# Altium schematic sheet adcbuffer.SchDoc
size A4; SheetNumber: 7; SheetTotal: 8
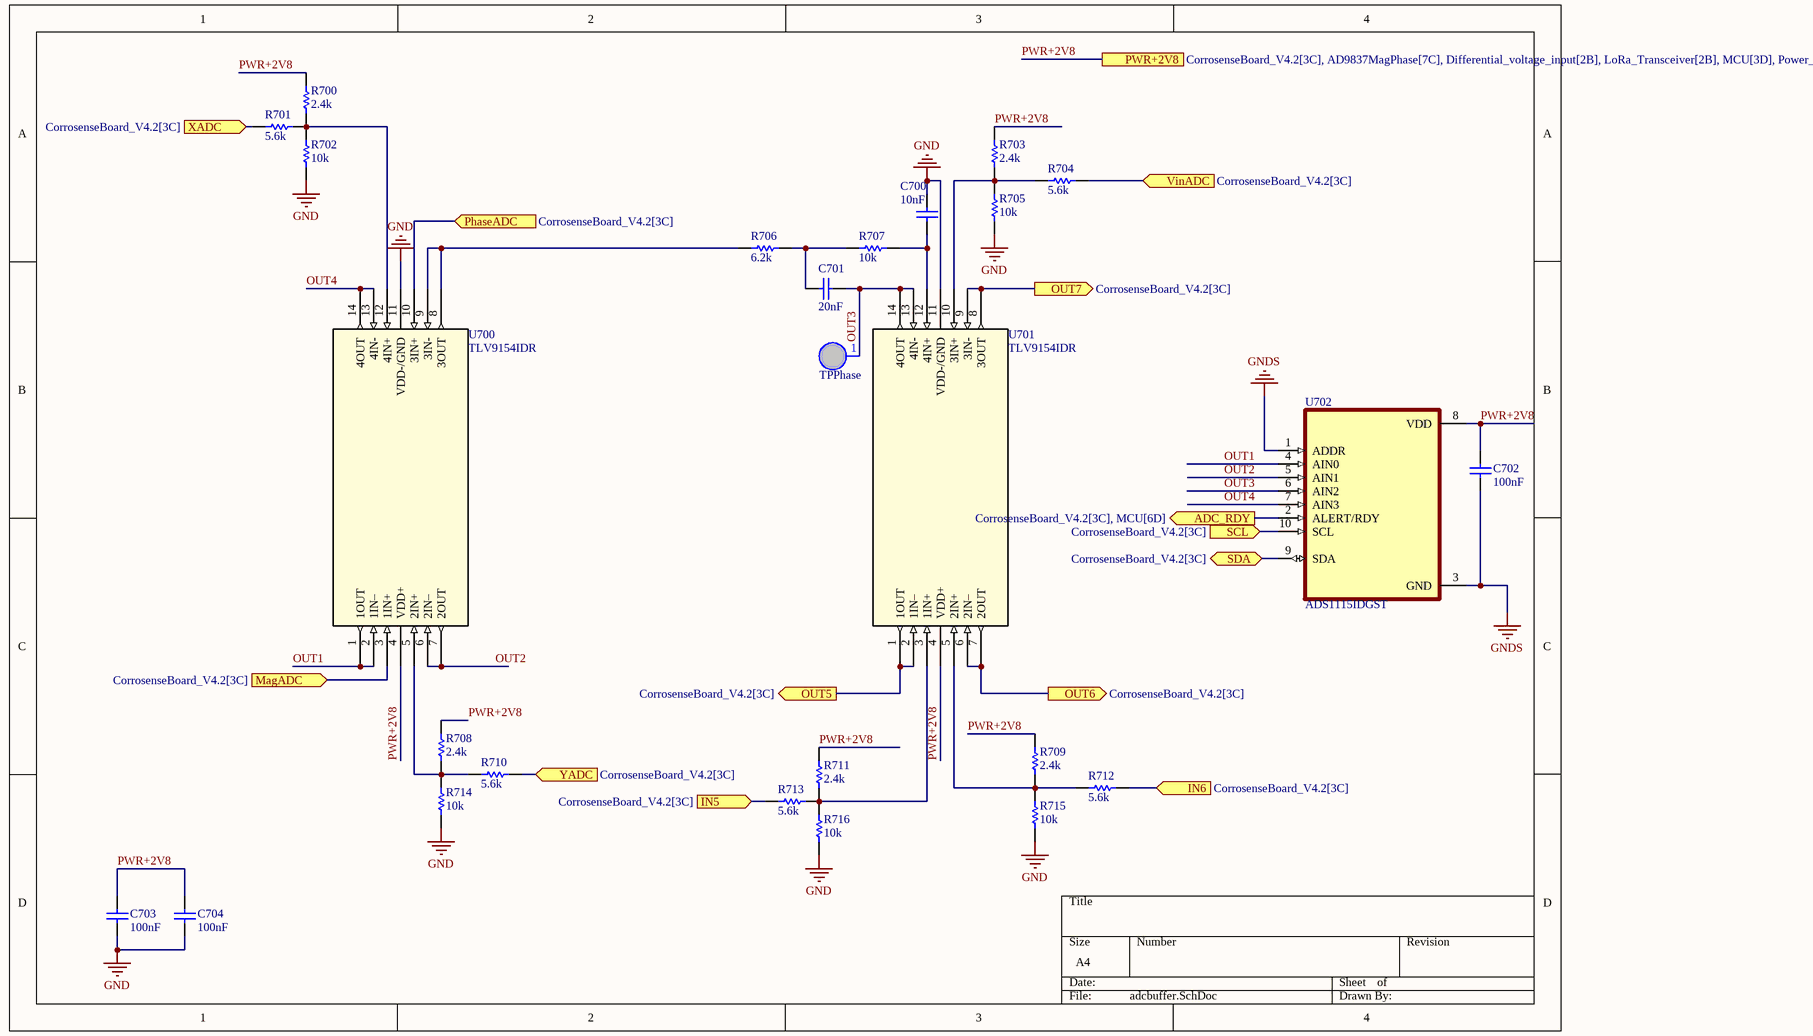
[diagram p0: adcbuffer.SchDoc]

## Parts
C700  10nF  [1608[0603]]
C701  20nF  [1608[0603]]
C702  100nF  [1608[0603]]
C703  100nF  [1608[0603]]
C704  100nF  [1608[0603]]
R700  2.4k  [1608[0603]]
R701  5.6k  [1608[0603]]
R702  10k  [1608[0603]]
R703  2.4k  [1608[0603]]
R704  5.6k  [1608[0603]]
R705  10k  [1608[0603]]
R706  6.2k  [1608[0603]]
R707  10k  [1608[0603]]
R708  2.4k  [1608[0603]]
R709  2.4k  [1608[0603]]
R710  5.6k  [1608[0603]]
R711  2.4k  [1608[0603]]
R712  5.6k  [1608[0603]]
R713  5.6k  [1608[0603]]
R714  10k  [1608[0603]]
R715  10k  [1608[0603]]
R716  10k  [1608[0603]]
TPPhase  TP  [PCBComponent_1]  (value not drawn)  (no BOM)
U700  TLV9154IDR  [SOIC127P600X175-14N]
U701  TLV9154IDR  [SOIC127P600X175-14N]
U702  ADS1115IDGST  [SOP50P490X110-10N]

## Ports
ADC_RDY (out, see CorrosenseBoard_V4.2[3C], MCU[6D]), IN5 (in, see CorrosenseBoard_V4.2[3C]), IN6 (in, see CorrosenseBoard_V4.2[3C]), MagADC (in, see CorrosenseBoard_V4.2[3C]), OUT5 (out, see CorrosenseBoard_V4.2[3C]), OUT6 (out, see CorrosenseBoard_V4.2[3C]), OUT7 (out, see CorrosenseBoard_V4.2[3C]), PhaseADC (in, see CorrosenseBoard_V4.2[3C]), PWR+2V8 (see CorrosenseBoard_V4.2[3C], AD9837MagPhase[7C], Differential_voltage_input[2B], LoRa_Transceiver[2B], MCU[3D], Power_management[3C]), SCL (in, see CorrosenseBoard_V4.2[3C]), SDA (bidir, see CorrosenseBoard_V4.2[3C]), VinADC (in, see CorrosenseBoard_V4.2[3C]), XADC (in, see CorrosenseBoard_V4.2[3C]), YADC (in, see CorrosenseBoard_V4.2[3C])

## Nets
GND: C700.2 C703.2 C704.2 R702.1 R705.1 R714.1 R715.1 R716.1 U700.11(VDD-/GND) U701.11(VDD-/GND)
GNDS: C702.2 U702.1(ADDR) U702.3(GND)
ADC_RDY: U702.2(ALERT/RDY) ; port ADC_RDY
IN5: R713.2 ; port IN5
IN6: R712.2 ; port IN6
MagADC: U700.3(1IN+) ; port MagADC
OUT1: U700.1(1OUT) U700.2(1IN–) U702.4(AIN0)
OUT2: U700.6(2IN–) U700.7(2OUT) U702.5(AIN1)
OUT3: C701.2 TPPhase.1 U701.13(4IN-) U701.14(4OUT) U702.6(AIN2)
OUT4: U700.13(4IN-) U700.14(4OUT) U702.7(AIN3)
OUT5: U701.1(1OUT) U701.2(1IN–) ; port OUT5
OUT6: U701.6(2IN–) U701.7(2OUT) ; port OUT6
OUT7: U701.8(3OUT) U701.9(3IN-) ; port OUT7
PhaseADC: U700.10(3IN+) ; port PhaseADC
PWR+2V8: C702.1 C703.1 C704.1 R700.2 R703.2 R708.2 R709.2 R711.2 U700.4(VDD+) U701.4(VDD+) U702.8(VDD) ; port PWR+2V8
SCL: U702.10(SCL) ; port SCL
SDA: U702.9(SDA) ; port SDA
VinADC: R704.2 ; port VinADC
XADC: R701.2 ; port XADC
YADC: R710.2 ; port YADC
NetC700_1: C700.1 R707.1 U701.12(4IN+)
NetC701_1: C701.1 R706.1 R707.2
NetR700_1: R700.1 R701.1 R702.2 U700.12(4IN+)
NetR703_1: R703.1 R704.1 R705.2 U701.10(3IN+)
NetR706_2: R706.2 U700.8(3OUT) U700.9(3IN-)
NetR708_1: R708.1 R710.1 R714.2 U700.5(2IN+)
NetR709_1: R709.1 R712.1 R715.2 U701.5(2IN+)
NetR711_1: R711.1 R713.1 R716.2 U701.3(1IN+)

## Library data of the parts
C700 = Cap: CAP CER 25V X7R 0603; Manufacturer: Murata Electronics; MPN: GCJ188R71E103KA01J; Tolerance: ±10%; Value: 10nF; Operating Temperature: -55°C ~ 125°C; Package / Case: 0603 (1608 Metric); Temperature Coefficient: X7R; Voltage - Rated: 25V
C701 = Cap: CAP CER 25V X7R 0603; Manufacturer: YAGEO; MPN: CC0603KRX7R9BB203; Tolerance: ±10%; Value: 20nF; Operating Temperature: -55°C ~ 125°C; Package / Case: 0603 (1608 Metric); Temperature Coefficient: X7R; Voltage - Rated: 25V
C702-C704 = Cap: CAP CER 25V X7R 0603; Manufacturer: Murata Electronics; MPN: GCJ188R71E104KA12D; Tolerance: ±10%; Value: 100nF; Operating Temperature: -55°C ~ 125°C; Package / Case: 0603 (1608 Metric); Temperature Coefficient: X7R; Voltage - Rated: 25V
R700 R703 R708 R709 R711 = Res1: RES SMD 2% 1.5W 0603; Manufacturer: YAGEO; MPN: AC0603FR-072K4L; MP: -65°C ~ 155°C; Publisher: Altium Limited; Value: 2.4k; Code_JEITA: Thick Film; Package: 0603 (1608 Metric); Temperature Coefficient: 2%; Composition: Thick Film; Operating Temperature: -65°C ~ 155°C; Power (Watts): 1.5W; Tolerance: 2%
R701 R704 R710 R712 R713 = Res1: RES SMD 2% 1.5W 0603; Manufacturer: YAGEO; MPN: RC0603FR-075K6L; MP: -65°C ~ 155°C; Publisher: Altium Limited; Value: 5.6k; Code_JEITA: Thick Film; Package: 0603 (1608 Metric); Temperature Coefficient: 2%; Composition: Thick Film; Operating Temperature: -65°C ~ 155°C; Power (Watts): 1.5W; Tolerance: 2%
R702 R705 R707 R714-R716 = Res1: RES SMD 2% 1.5W 0603; Manufacturer: YAGEO; MPN: RC0603FR-0710KL; MP: -65°C ~ 155°C; Publisher: Altium Limited; Value: 10k; Code_JEITA: Thick Film; Package: 0603 (1608 Metric); Temperature Coefficient: 2%; Composition: Thick Film; Operating Temperature: -65°C ~ 155°C; Power (Watts): 1.5W; Tolerance: 2%
R706 = Res1: RES SMD 2% 1.5W 0603; Manufacturer: YAGEO; MPN: AC0603FR-076K2L; MP: -65°C ~ 155°C; Publisher: Altium Limited; Value: 6.2k; Code_JEITA: Thick Film; Package: 0603 (1608 Metric); Temperature Coefficient: 2%; Composition: Thick Film; Operating Temperature: -65°C ~ 155°C; Power (Watts): 1.5W; Tolerance: 2%
U700 U701 = TLV2444CD: No Description Available; Mfr_Name: Texas Instruments; RefDes: RefDes; Type: Type; Manufacturer: Texas Instruments; MPN: TLV9154IDR
U702 = ADS1115IDGST: Manufacturer: Texas Instruments; MP: ADS1115IDGST; Value: *; Price: None; Package: None; Availability: Unavailable; MPN: ADS1115IDGST